# EAGLE design LM13700 VCA exp only B001 (EAGLE 7.4.0)
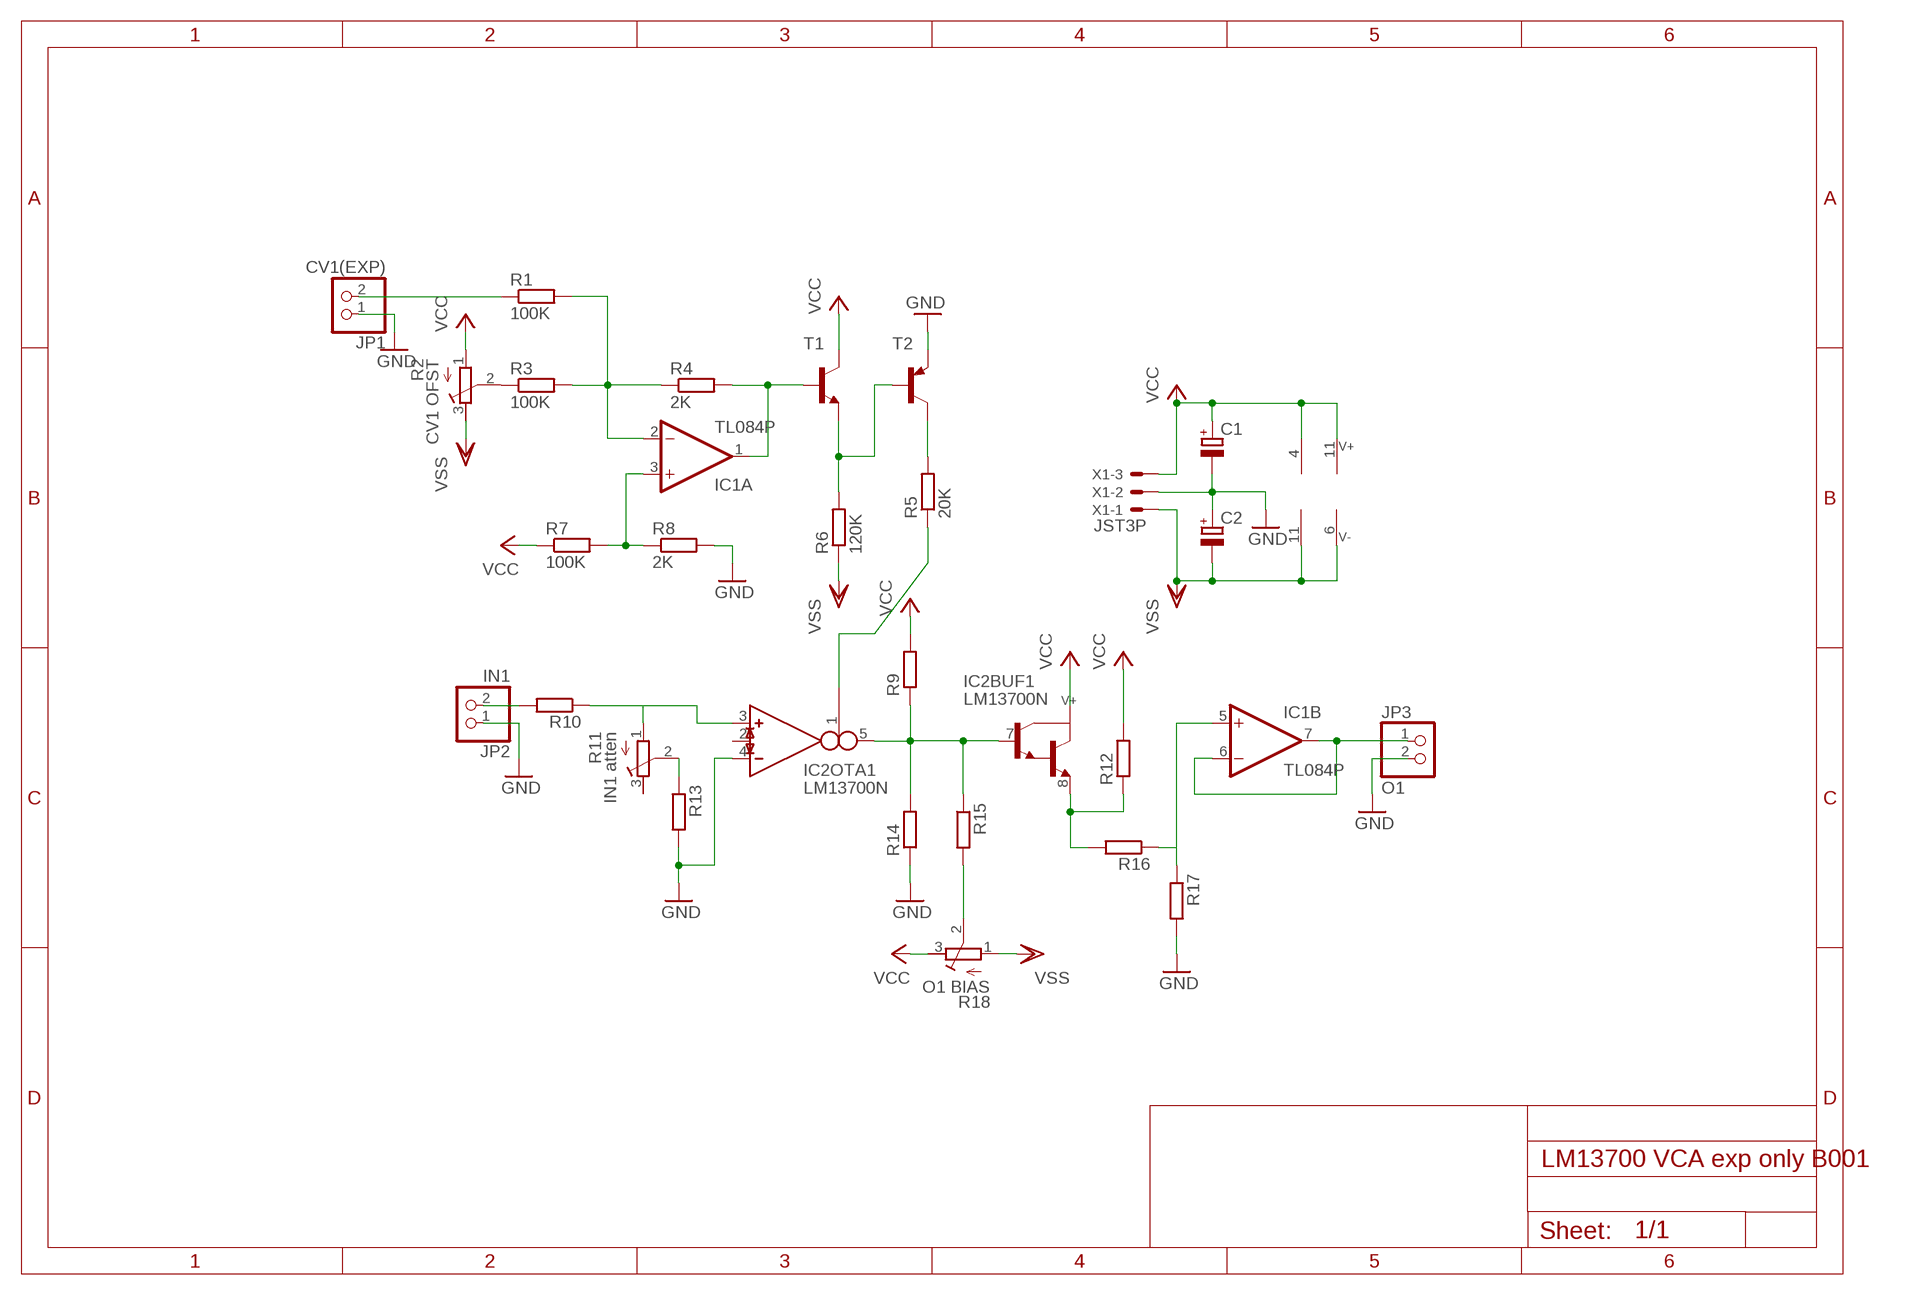
[diagram p0: schematic, sheet 1]

## Parts
C1  CPOL-EUE2.5-7  [E2,5-7]
C2  CPOL-EUE2.5-7  [E2,5-7]
IC1  TL084P  [DIL14]
IC2  LM13700N  [DIL16]
JP1  CV1(EXP)  PINHD-1X2  [1X02]
JP2  IN1  PINHD-1X2  [1X02]
JP3  O1  PINHD-1X2  [1X02]
R1  100K  R-EU_0204/2V  [0204V]
R2  CV1 OFST  R-TRIMM64W  [RTRIM64W]
R3  100K  R-EU_0204/7  [0204/7]
R4  2K  R-EU_0204/2V  [0204V]
R5  20K  R-EU_0204/7  [0204/7]
R6  120K  R-EU_0204/7  [0204/7]
R7  100K  R-EU_0204/7  [0204/7]
R8  2K  R-EU_0204/7  [0204/7]
R9  R-EU_0204/5  [0204/5]
R10  R-EU_0204/2V  [0204V]
R11  IN1 atten  R-TRIMM64W  [RTRIM64W]
R12  R-EU_0204/7  [0204/7]
R13  R-EU_0204/2V  [0204V]
R14  R-EU_0204/2V  [0204V]
R15  R-EU_0204/7  [0204/7]
R16  R-EU_0204/7  [0204/7]
R17  R-EU_0204/5  [0204/5]
R18  O1 BIAS  R-TRIMM64W  [RTRIM64W]
T1  2N3904-NPN-TO92-EBC  [TO92-EBC]
T2  2N3906-PNP-TO92-EBC  [TO92-EBC]
X1  JST3P  JST-XH-03-PIN-LONG-PAD  [JST-XH-03-PACKAGE-LONG-PAD]

## Nets
GND: C1.- C2.+ IC2.4(OTA1:IN_N) JP1.1 JP2.1 JP3.2 R8.2 R13.2 R14.1 R17.2 T2.E X1.2
N$1: IC1.3(A:+IN) R7.2 R8.1
N$2: IC1.2(A:-IN) R1.2 R3.2 R4.1
N$3: IC1.1(A:OUT) R4.2 T1.B
N$4: R6.2 T1.E T2.B
N$5: R5.2 T2.C
N$6: JP1.2 R1.1
N$7: R2.2(S) R3.1
N$8: IC2.1(OTA1:I_BIAS) R5.1
N$9: IC2.3(OTA1:IN_P) R10.1 R11.1(A)
N$12: IC2.5(OTA1:OUT) IC2.7(BUF1:B) R9.1 R14.2 R15.1
N$13: R15.2 R18.2(S)
N$14: IC2.8(BUF1:E) R12.1 R16.2
N$16: IC1.5(B:+IN) R16.1 R17.1
N$17: IC1.6(B:-IN) IC1.7(B:OUT) JP3.1
N$18: JP2.2 R10.2
N$37: R11.2(S) R13.1
V-: C2.- IC1.11(P:V-) IC2.6(SUPPLY:V-) X1.1 ; supply symbol labelled VSS
VCC: C1.+ IC1.4(P:V+) IC2.11(SUPPLY:V+) R2.1(A) R7.1 R9.2 R12.2 R18.3(E) T1.C X1.3
VSS: R2.3(E) R6.1 R18.1(A)
Unconnected: IC1.8(C:OUT) IC1.9(C:-IN) IC1.10(C:+IN) IC1.12(D:+IN) IC1.13(D:-IN) IC1.14(D:OUT) IC2.2(OTA1:I_DIODE) IC2.9(BUF2:E) IC2.10(BUF2:B) IC2.12(OTA2:OUT) IC2.13(OTA2:IN_N) IC2.14(OTA2:IN_P) IC2.15(OTA2:I_DIODE) IC2.16(OTA2:I_BIAS) R11.3(E)

## Library data of the parts
C1 C2 = rcl:CPOL-EU: POLARIZED CAPACITOR, European symbol
IC1 = linear:TL084: OP AMP
IC2 = ota:LM13700: Dual OTA with buffers
JP1-JP3 = pinhead:PINHD-1X2: PIN HEADER
R1 R3-R10 R12-R17 = rcl:R-EU_: RESISTOR, European symbol
R2 R11 R18 = resistor:R-TRIMM: Trimm resistor
T1 = transistor-neu-to92:*-NPN-: NPN Transistror
T2 = transistor-neu-to92:*-PNP-: PNP Transistror
X1 = Rembrandt Electronics - JST XH Connectors v1-0:JST-XH-03-PIN: JST XH Connector 2 Pin Wire to board connector. Pitch: 2,54 mm, (0.100") Number of pins: 3 Created by Rembrandt Electronics www.rembrandtelectronics.com

## Board
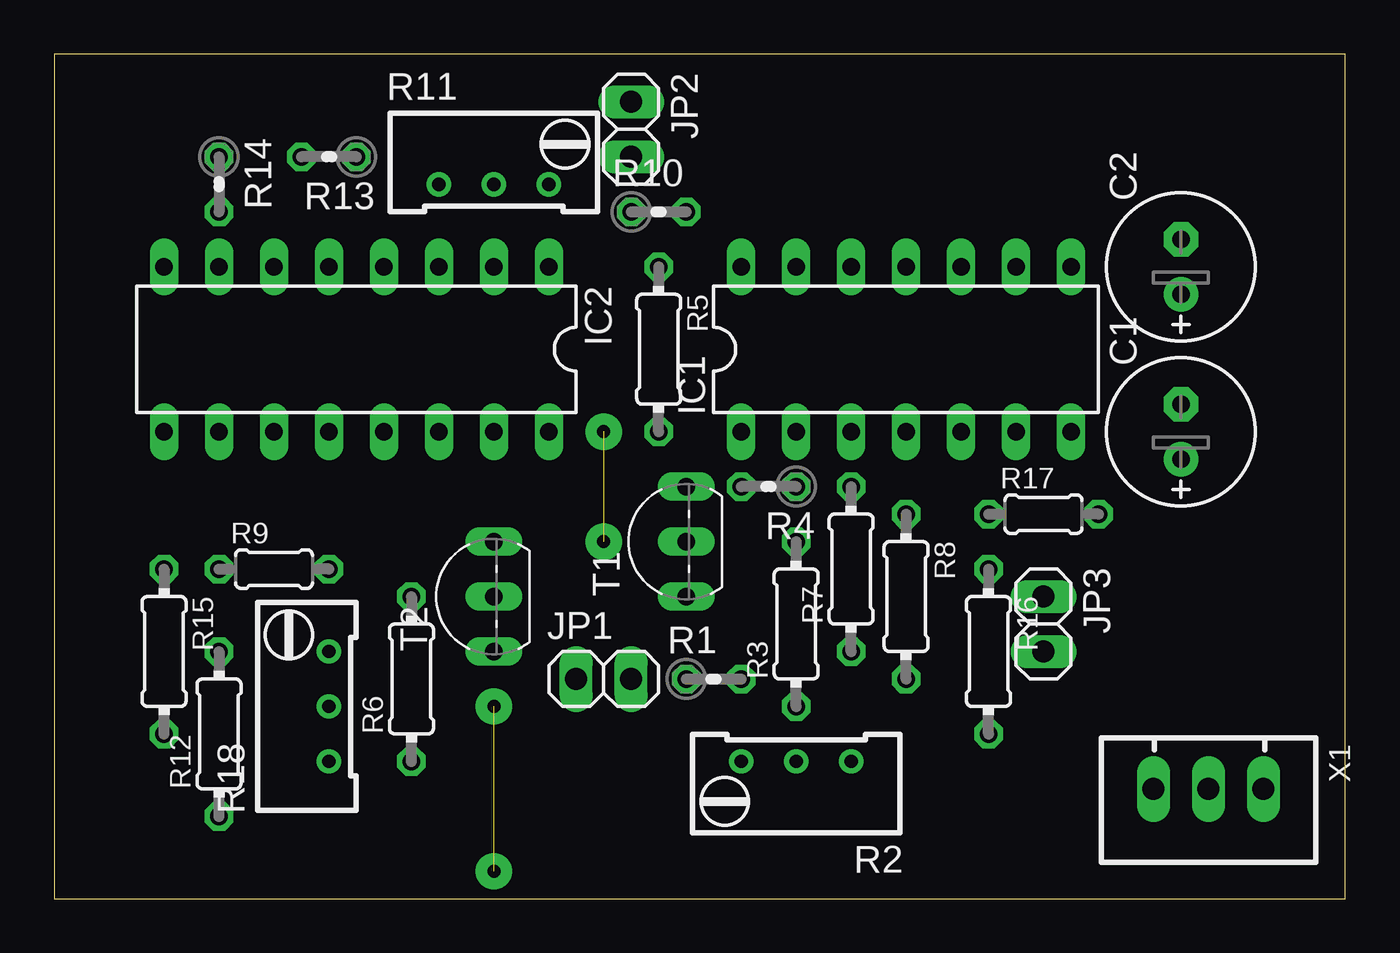
[diagram p1: board, top side]
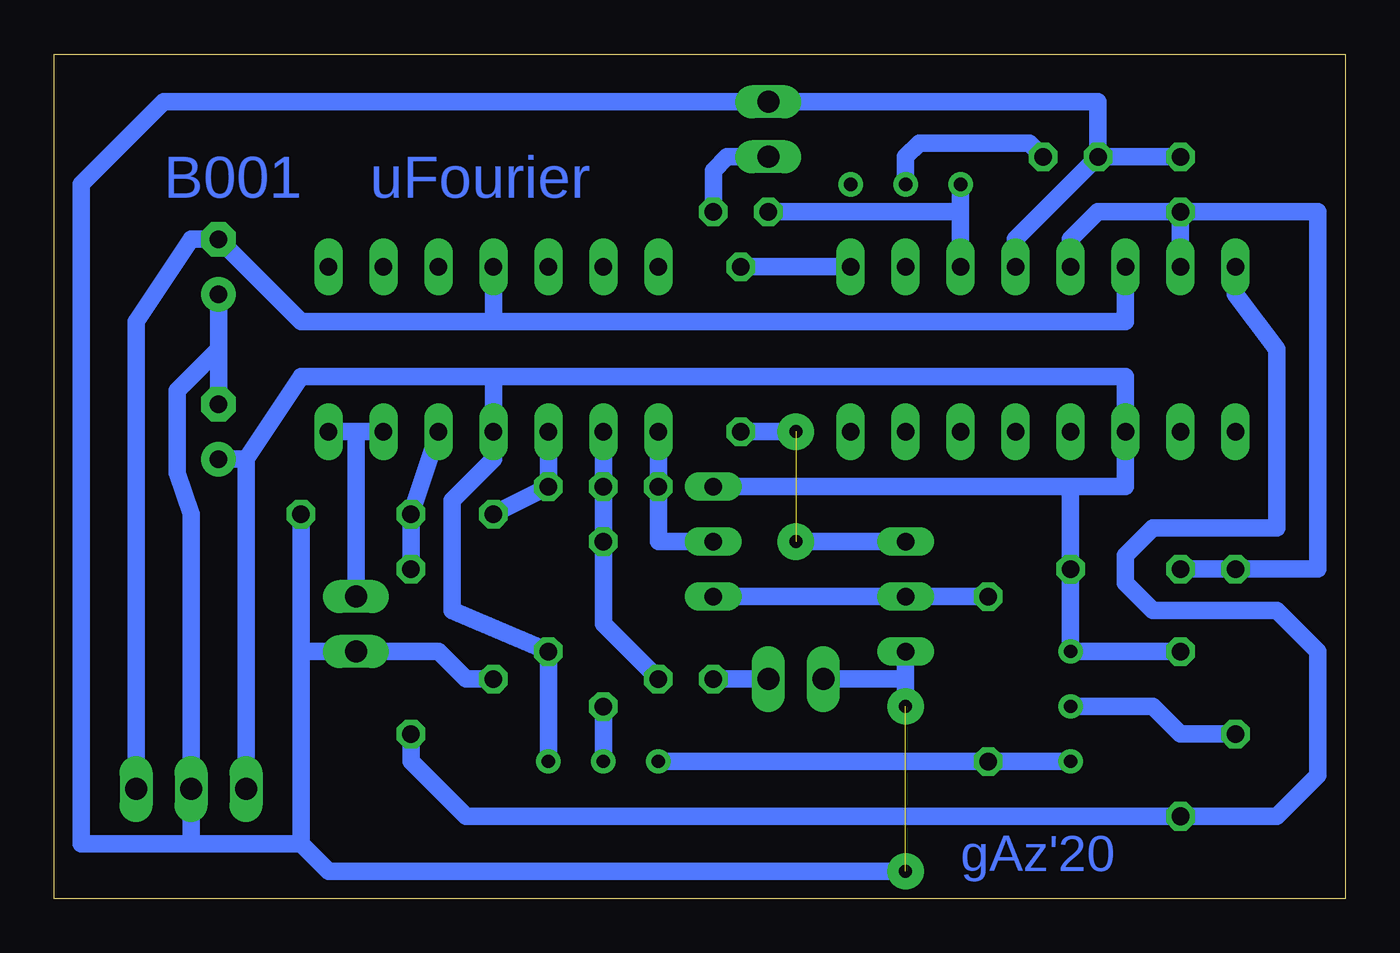
[diagram p2: board, bottom side, seen from below]

Size 59.67 x 39.04 mm. Coordinates in mm from the lower left corner, seen from the top.
Outline: 0,0 59.67,0 59.67,39.04 0,39.04 0,0
Copper layers (1*16): Top 0.035mm / dielectric 1.5mm / Bottom 0.035mm
Design rules "default": minimum track width 10mil, minimum drill 24mil, track to track 8mil, track to pad 8mil, pad to pad 8mil, via to via 8mil, smd to smd 8mil, copper to edge 40mil, drill to drill 8mil, minimum pad ring 10mil, minimum via ring 8mil, stop-mask expansion 4mil, vias tented up to drill 0mil, thermal gap 10mil

### Footprints (pad centres in the part's own frame; a part is rotated, then mirrored left to right if it is on the bottom)
E2,5-7 = drill 0.813 pad 1.6: + -1.27,0 | drill 0.813 pad 1.6 octagon: - 1.27,0
DIL14 = drill 0.813 long: 1 -7.62,-3.81; 2 -5.08,-3.81; 3 -2.54,-3.81; 4 0,-3.81; 5 2.54,-3.81; 6 5.08,-3.81; 7 7.62,-3.81; 8 7.62,3.81; 9 5.08,3.81; 10 2.54,3.81; 11 0,3.81; 12 -2.54,3.81; 13 -5.08,3.81; 14 -7.62,3.81
DIL16 = drill 0.813 long: 1 -8.89,-3.81; 2 -6.35,-3.81; 3 -3.81,-3.81; 4 -1.27,-3.81; 5 1.27,-3.81; 6 3.81,-3.81; 7 6.35,-3.81; 8 8.89,-3.81; 9 8.89,3.81; 10 6.35,3.81; 11 3.81,3.81; 12 1.27,3.81; 13 -1.27,3.81; 14 -3.81,3.81; 15 -6.35,3.81; 16 -8.89,3.81
1X02 = drill 1.016 long: 1 -1.27,0; 2 1.27,0
0204V = drill 0.813 octagon: 1 -1.27,0; 2 1.27,0
RTRIM64W = drill 0.61: 1 1.27,-2.54; 2 1.27,0; 3 1.27,2.54
0204/7 = drill 0.813 octagon: 1 -3.81,0; 2 3.81,0
0204/5 = drill 0.813 octagon: 1 -2.54,0; 2 2.54,0
TO92-EBC = drill 0.813 long: B 0,-1.27; C 2.54,-1.27; E -2.54,-1.27
JST-XH-03-PACKAGE-LONG-PAD = drill 1.016 long: 1 -2.54,0; 2 0,0; 3 2.54,0

### Placement (x,y rotation side)
C1  52.07,21.59 90 top
C2  52.07,29.21 90 top
IC1  39.37,25.4 0 top
IC2  13.97,25.4 180 top
JP1  25.4,10.16 0 top
JP2  26.67,35.56 270 top
JP3  45.72,12.7 270 top
R1  30.48,10.16 0 top
R2  34.29,5.08 90 top
R3  34.29,12.7 90 top
R4  33.02,19.05 180 top
R5  27.94,25.4 270 top
R6  16.51,10.16 90 top
R7  36.83,15.24 90 top
R8  39.37,13.97 270 top
R9  10.16,15.24 0 top
R10  27.94,31.75 0 top
R11  20.32,34.29 270 top
R12  7.62,7.62 90 top
R13  12.7,34.29 180 top
R14  7.62,33.02 270 top
R15  5.08,11.43 270 top
R16  43.18,11.43 270 top
R17  45.72,17.78 0 top
R18  11.43,8.89 0 top
T1  27.94,16.51 90 top
T2  19.05,13.97 90 top
X1  53.34,5.08 180 top

### Tracks (layer width: path | path; a pad name or v marks a point on that pad's centre or on a via)
GND  (via drill 0.6 pad 1.68)  (1 unrouted)
  Bottom 0.813: C2.+ 52.07,25.4 | 52.07,25.4 53.98,23.5 53.98,19.68 53.34,17.78 X1.2 53.34,2.54 | R8.2 40.64,10.16 41.91,11.43 JP3.2 48.26,11.43 | C1.- 52.07,25.4 | 48.26,2.54 46.99,1.27 v20.32,1.27 | 48.26,11.43 48.26,2.54 | T2.E 20.32,10.16 | 20.32,10.16 JP1.1 | IC2.4 15.24,30.48 R13.2 | v20.32,8.89 20.32,10.16 | R14.1 R13.2 | R13.2 11.43,36.83 JP2.1 54.61,36.83 58.42,33.02 58.42,2.54 53.34,2.54 | R17.2 48.26,11.43 | 48.26,2.54 53.34,2.54
N$1
  Bottom 0.813: R8.1 R7.2 IC1.3
N$2
  Bottom 0.813: R4.1 IC1.2 | R3.2 R4.1 | R1.2 34.29,12.7 R4.1
N$3
  Bottom 0.813: IC1.1 R4.2 31.75,16.51 T1.B
N$4
  Bottom 0.813: R6.2 T2.B T1.E
N$5  (via drill 0.6 pad 1.68)  (1 unrouted)
  Bottom 0.813: T2.C v25.4,16.51 | R5.2 25.4,21.59
N$6
  Bottom 0.813: JP1.2 R1.1
N$7
  Bottom 0.813: R2.2 R3.1
N$8
  Bottom 0.813: IC2.1 R5.1
N$9
  Bottom 0.813: 17.78,31.75 IC2.3 | R11.1 17.78,31.75 | 17.78,31.75 R10.1
N$10  (via drill 0.6 pad 1.68)
  other vias: 25.4,21.59
N$12
  Bottom 0.813: IC2.5 12.7,30.48 11.43,31.75 R14.2 | R14.2 IC2.7 | R14.2 1.27,31.75 1.27,15.24 R15.1 R9.1
N$13
  Bottom 0.813: R18.2 8.89,8.89 7.62,7.62 R15.2
N$14
  Bottom 0.813: R16.2 43.18,6.35 40.64,3.81 R12.1 3.17,3.81 1.27,5.71 1.27,11.43 3.17,13.34 8.89,13.34 10.16,14.61 10.16,15.88 8.89,17.14 3.17,17.14 3.17,25.4 5.08,27.94 IC2.8
N$16
  Bottom 0.813: IC1.5 R17.1 R16.1
N$17
  Bottom 0.813: IC1.7 IC1.6 45.72,21.59 JP3.1
N$18
  Bottom 0.813: JP2.2 28.57,34.29 29.21,33.66 R10.2
N$37
  Bottom 0.813: R11.2 20.32,34.29 19.68,34.92 14.61,34.92 R13.1
V-
  Bottom 0.813: X1.1 55.88,26.67 53.34,30.48 C2.- 48.26,26.67 39.37,26.67 | 39.37,26.67 10.16,26.67 IC2.6 | IC1.11 39.37,26.67
VCC
  Bottom 0.813: 39.37,24.13 IC1.4 39.37,20.32 41.27,18.41 41.27,13.34 R7.1 R2.1 | X1.3 50.8,20.32 | 39.37,24.13 10.16,24.13 IC2.11 10.16,19.05 12.7,19.05 | C1.+ 50.8,20.32 | 50.8,20.32 48.26,24.13 39.37,24.13 | 12.7,19.05 T1.C | R12.2 R18.3 R9.2 12.7,19.05
VSS
  Bottom 0.813: R2.3 R6.1 R18.1

### Text on the board
Bottom: uFourier | B001 | gAz'20